# Altium schematic sheet Mach-rasp.SchDoc
size A3
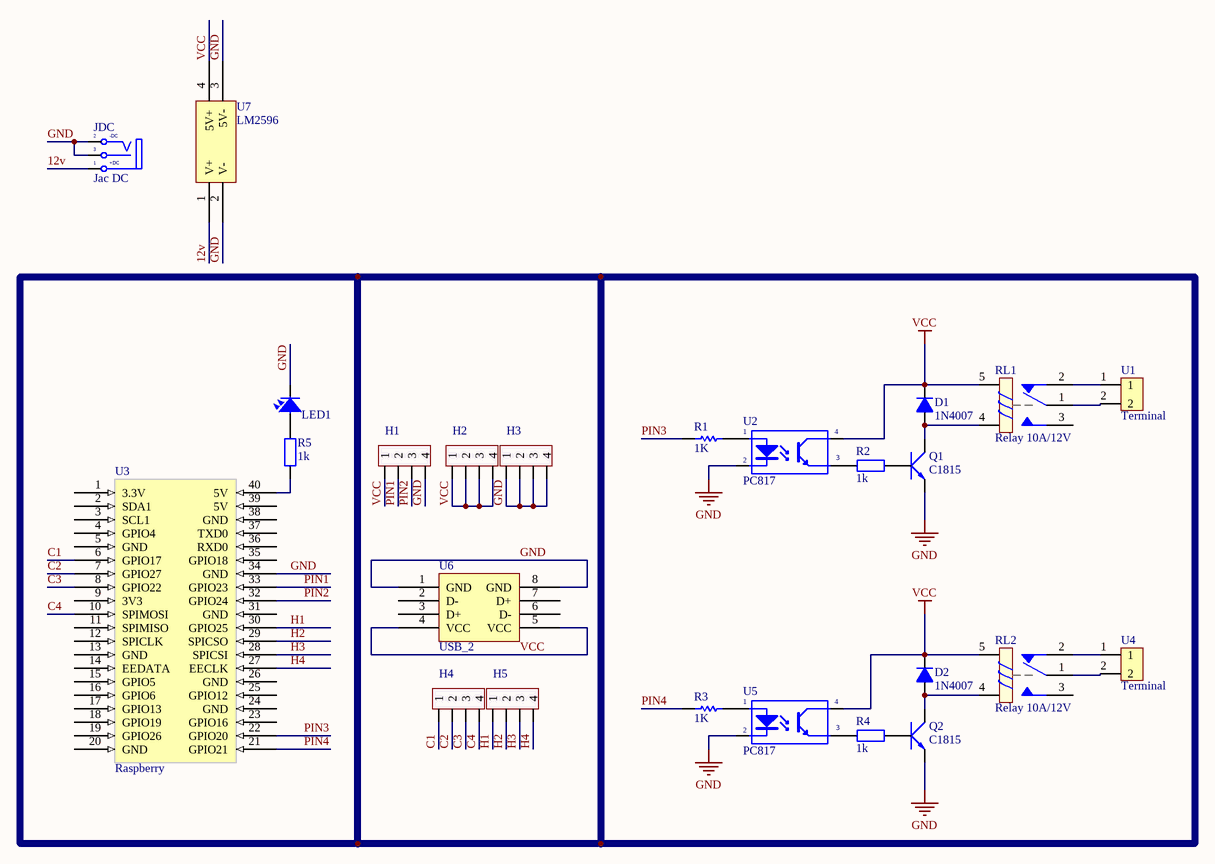
[diagram p0: Mach-rasp.SchDoc]

## Parts
D1  1N4007  [D1A]
D2  1N4007  [D1A]
H1  Header4  [Header4]  (value not drawn)
H2  Header4  [Header4]  (value not drawn)
H3  Header4  [Header4]  (value not drawn)
H4  Header4  [Header4]  (value not drawn)
H5  Header4  [Header4]  (value not drawn)
JDC  Jac DC  [DC-IN]
LED1  LED  [LED-3]  (value not drawn)
Q1  C1815  [QTO-92]
Q2  C1815  [QTO-92]
R1  value 1K  [R1/4W]  (hidden comment: Res1)
R2  1k  [R1/4W]
R3  value 1K  [R1/4W]  (hidden comment: Res1)
R4  1k  [R1/4W]
R5  1k  [R1/4W]
RL1  Relay 10A/12V  [RL_SPDT_10A]
RL2  Relay 10A/12V  [RL_SPDT_10A]
U1  Terminal  [Terminal 5.08]
U2  PC817  [DIP4/W0.3]
U3  Raspberry  [Raspberry]
U4  Terminal  [Terminal 5.08]
U5  PC817  [DIP4/W0.3]
U6  USB_2  [USB_2]
U7  LM2596  [LM2596]

## Nets
GND: H1.4 H3.1 H3.2 H3.3 H3.4 JDC.2(TN) JDC.3(S) LED1.2 Q1.1(E) Q2.1(E) U2.2(K) U3.34(GND) U5.2(K) U6.1(GND) U6.8(GND) U7.2(V-) U7.3(5V-)
VCC: D1.2(K) D2.2(K) H1.1 H2.1 H2.2 H2.3 H2.4 RL1.5 RL2.5 U2.4(C) U5.4(C) U6.4(VCC) U6.5(VCC) U7.4(5V+)
12v: JDC.1(T) U7.1(V+)
C1: H4.1 U3.6(GPIO17)
C2: H4.2 U3.7(GPIO27)
C3: H4.3 U3.8(GPIO22)
C4: H4.4 U3.10(SPIMOSI)
H1: H5.1 U3.30(GPIO25)
H2: H5.2 U3.29(SPICSO)
H3: H5.3 U3.28(SPICSI)
H4: H5.4 U3.27(EECLK)
PIN1: H1.2 U3.33(GPIO23)
PIN2: H1.3 U3.32(GPIO24)
PIN3: R1.2 U3.22(GPIO20)
PIN4: R3.2 U3.21(GPIO21)
NetD1_1: D1.1(A) Q1.2(C) RL1.4
NetD2_1: D2.1(A) Q2.2(C) RL2.4
NetLED1_1: LED1.1 R5.2
NetQ1_3: Q1.3(B) R2.2
NetQ2_3: Q2.3(B) R4.2
NetR1_1: R1.1 U2.1(A)
NetR2_1: R2.1 U2.3(E)
NetR3_1: R3.1 U5.1(A)
NetR4_1: R4.1 U5.3(E)
NetR5_1: R5.1 U3.40(5V)
NetRL1_1: RL1.1 U1.2
NetRL1_2: RL1.2 U1.1
NetRL2_1: RL2.1 U4.2
NetRL2_2: RL2.2 U4.1

Not connected (* = marked no-connect by the designer): RL1 3; RL2 3; U3 1(3.3V) 2(SDA1) 3(SCL1) 4(GPIO4) 5(GND) 9(3V3) 11(SPIMISO) 12(SPICLK) 13(GND) 14(EEDATA) 15(GPIO5) 16(GPIO6) 17(GPIO13) 18(GPIO19) 19(GPIO26) 20(GND) 23(GPIO16) 24(GND) 25(GPIO12) 26(GND) 31(GND) 35(GPIO18) 36(RXD0) 37(TXD0) 38(GND) 39(5V); U6 2(D-) 3(D+) 6(D-) 7(D+)

## Notes on the sheet
- (in symbol DCIN) -DC; +DC

## Library data of the parts
D1 D2 = D1A: Diode 1A; Value: 1N4007
H1-H5 = Header4: Header IDC, 4 x 1 Pin Vertical 2.54mm Pitch (Non-Boxed, Male)
JDC = DCIN: Jac DC input; Value: Jac DC
LED1 = LED: LED Single colour Green and Red; Value: LED 3 ly Single Colour
Q1 Q2 = C1815: NPN 600mW, ECB; Value: C1815
R1 R3 = Res1_4: Resistor; Manufacturer: Generic Components; Class: Passive; Published: 08/06/2000; Publisher: Altium Hobart Technology Centre; SubClass: Resistor
R2 R4 R5 = R1/4W: Resistor 1/4W; Value: R1/4W - 1K
RL1 RL2 = Relay 1: Relay SPDT,10A - 12VDC 5 Pin; Value: Relay SPDT, 10A, 12V
U1 U4 = TERMINAL5.08
U2 U5 = PC817: Single Opto; Value: PC817
U6 = USB_2: USB